# EAGLE design MicroChu-328-V2-Final (EAGLE 6.2)
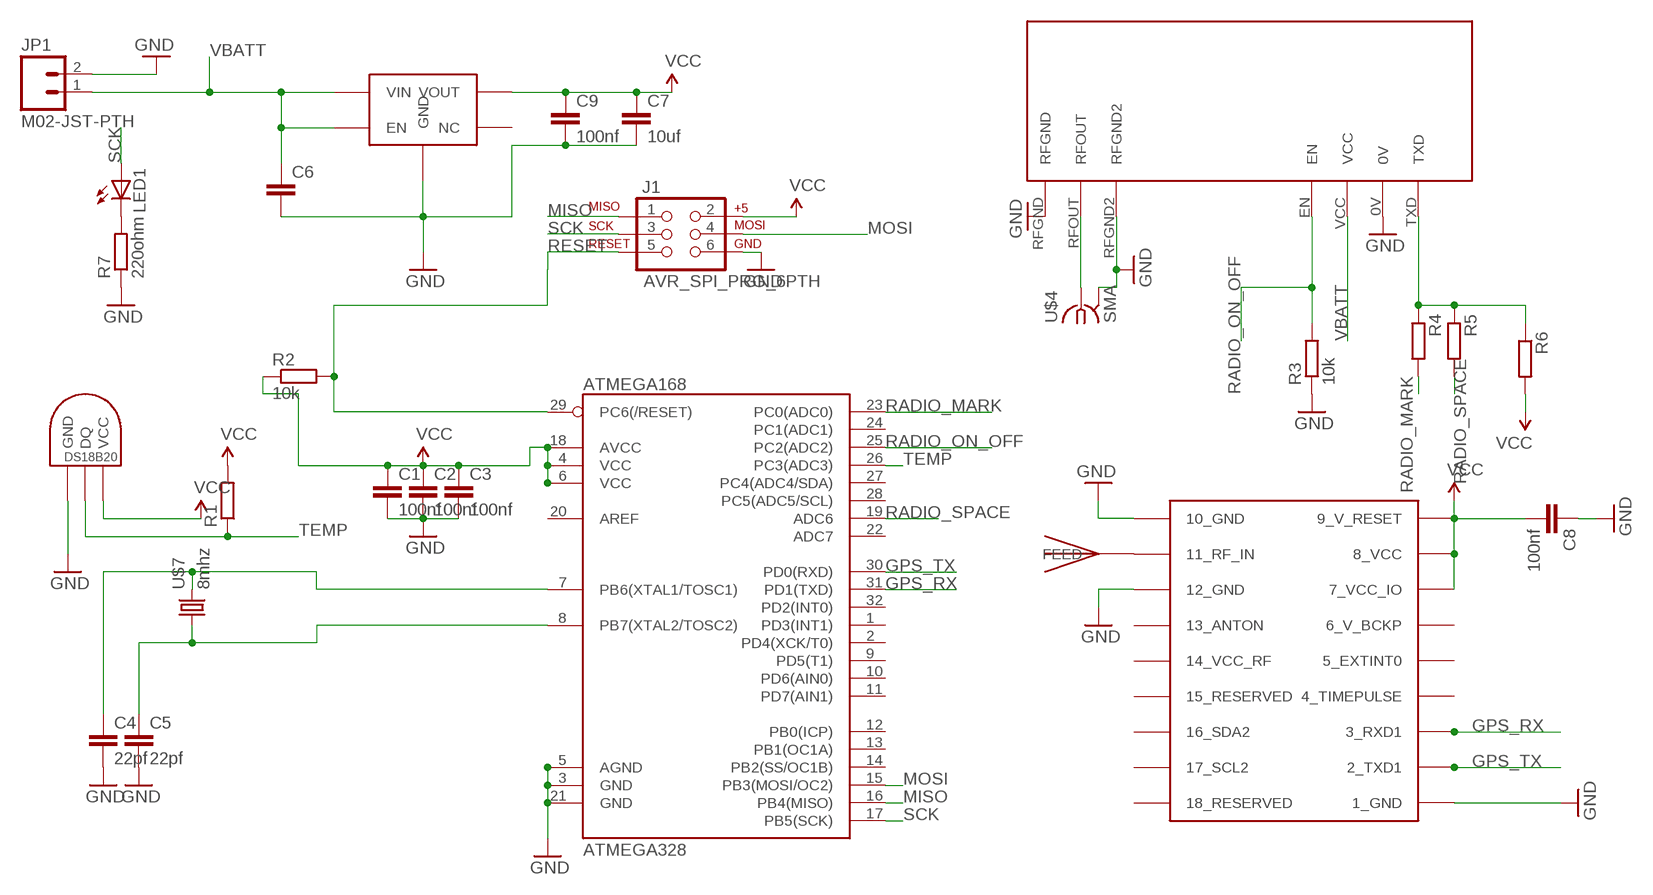
[diagram p0: schematic, sheet 1]

## Parts
3V3  ADP122AUJZ-3V3REG-5TSOT  [SOT23-5L]
ATMEGA328  ATMEGA168  [TQFP32-08]
C1  100nf  C-EUC0805  [C0805]
C2  100nf  C-EUC0805  [C0805]
C3  100nf  C-EUC0805  [C0805]
C4  22pf  C-EUC0805  [C0805]
C5  22pf  C-EUC0805  [C0805]
C6  C-EUC0805  [C0805]
C7  10uf  C-EUC0805  [C0805]
C8  100nf  C-EUC0805  [C0805]
C9  100nf  C-EUC0805  [C0805]
J1  AVR_SPI_PRG_6PTH  [2X3]
JP1  M02-JST-PTH  [M02-JST-PTH]
LED1  LED1206  [LED-1206]
R1  R-EU_R0805  [R0805]
R2  10k  R-EU_R0805  [R0805]
R3  10k  R-EU_R0805  [R0805]
R4  R-EU_R0805  [R0805]
R5  R-EU_R0805  [R0805]
R6  R-EU_R0805  [R0805]
R7  220ohm  R-EU_R0805  [R0805]
U$1  JTI_ANTENNA-1575AT43A40  [JTI_ANTENNA-1575AT43A40]
U$2  NTX2  [NTX2]
U$3  UBLOX_MAX-6  [UBLOX_MAX-6]
U$4  SMA  BU-SMA-H  [BU-SMA-H]
U$6  DS1820TO92  [DS1820]
U$7  8mhz  ABRACON_ABM3_CRYSTAL  [ABRACON_ABM3_CRYSTAL]

## Nets
GND: 3V3.2(GND) ATMEGA328.3(GND) ATMEGA328.5(AGND) ATMEGA328.21(GND) C1.2 C2.2 C3.2 C4.2 C5.2 C6.2 C7.2 C8.1 C9.2 J1.6 JP1.2 R3.1 R7.1 U$2.0V U$2.RFGND U$2.RFGND2 U$3.1_GND U$3.10_GND U$3.12_GND U$4.2(GND) U$6.GND
GPS_RX: ATMEGA328.31(PD1(TXD)) U$3.3_RXD1
GPS_TX: ATMEGA328.30(PD0(RXD)) U$3.2_TXD1
MISO: ATMEGA328.16(PB4(MISO)) J1.1
MOSI: ATMEGA328.15(PB3(MOSI/OC2)) J1.4
N$1: ATMEGA328.7(PB6(XTAL1/TOSC1)) C4.1 U$7.P$2
N$2: LED1.C R7.2
N$3: ATMEGA328.8(PB7(XTAL2/TOSC2)) C5.1 U$7.P$1
N$4: U$1.FEED U$3.11_RF_IN
N$5: R4.1 R5.1 R6.1 U$2.TXD
N$10: U$2.RFOUT U$4.1
RADIO_MARK: ATMEGA328.23(PC0(ADC0)) R4.2
RADIO_ON_OFF: ATMEGA328.25(PC2(ADC2)) R3.2 U$2.EN
RADIO_SPACE: ATMEGA328.19(ADC6) R5.2
RESET: ATMEGA328.29(PC6(/RESET)) J1.5 R2.2
SCK: ATMEGA328.17(PB5(SCK)) J1.3 LED1.A
TEMP: ATMEGA328.26(PC3(ADC3)) R1.1 U$6.DQ
VBATT: 3V3.1(VIN) 3V3.3(EN) C6.1 JP1.1 U$2.VCC
VCC: 3V3.5(VOUT) ATMEGA328.4(VCC) ATMEGA328.6(VCC) ATMEGA328.18(AVCC) C1.1 C2.1 C3.1 C7.1 C8.2 C9.1 J1.2 R1.2 R2.1 R6.2 U$3.7_VCC_IO U$3.8_VCC U$3.9_V_RESET U$6.VDD(VCC)
Unconnected: 3V3.4(NC) ATMEGA328.1(PD3(INT1)) ATMEGA328.2(PD4(XCK/T0)) ATMEGA328.9(PD5(T1)) ATMEGA328.10(PD6(AIN0)) ATMEGA328.11(PD7(AIN1)) ATMEGA328.12(PB0(ICP)) ATMEGA328.13(PB1(OC1A)) ATMEGA328.14(PB2(SS/OC1B)) ATMEGA328.20(AREF) ATMEGA328.22(ADC7) ATMEGA328.24(PC1(ADC1)) ATMEGA328.27(PC4(ADC4/SDA)) ATMEGA328.28(PC5(ADC5/SCL)) ATMEGA328.32(PD2(INT0)) U$3.4_TIMEPULSE U$3.5_EXTINT0 U$3.6_V_BCKP U$3.13_ANTON U$3.14_VCC_RF U$3.15_RESERVED U$3.16_SDA2 U$3.17_SCL2 U$3.18_RESERVED

## Power pins joined to a net without a drawn wire
GND: U$4.3(GND) U$4.4(GND) U$4.5(GND)

## Library data of the parts
3V3 = jonsowman:ADP122AUJZ-3V3REG-5TSOT
ATMEGA328 = SparkFun:ATMEGA168
C1-C9 = rcl:C-EU: CAPACITOR, European symbol
J1 = SparkFun:AVR_SPI_PRG_6: AVR ISP 6 Pin This is the reduced ISP connector for AVR programming. Common on Arduino. This footprint will take up less PCB space and can be used with a 10-pin to 6-pin adapter such as SKU: BOB-08508
JP1 = ava:M02-JST-PTH
LED1 = SparkFun:LED: LEDs Standard schematic elements and footprints for 5mm, 3mm, 1206, and 0603 sized LEDs. 5mm - Spark Fun Electronics SKU : COM-00529 (and others)
R1-R7 = resistor:R-EU_: RESISTOR, European symbol
U$1 = ava:JTI_ANTENNA-1575AT43A40
U$2 = ava:NTX2: Radiometrix NTX2 Transmitter Module Author Anthony Stirk / http://ava.upuaut.net
U$3 = ava:UBLOX_MAX-6: UBLOX MAX-6
U$4 = con-coax:BU-SMA-H: FEMALE SMA CONNECTOR Radiall; OC_FARNELL: unknown; OC_NEWARK: unknown
U$6 = ava:DS1820: DS18B20 Programmable Resolution 1-Wire Digital Thermometer Description The DS18B20 digital thermometer provides 9-bit to 12-bit Celsius temperature measurements and has an alarm function with nonvolatile user-programmable upper and lower trigger points. The DS18B20 communicates over a 1-Wire® bus that by definition requires only one data line (and ground) for communication with a central microprocessor. It has an operating temperature range of -55°C to +125°C and is accurate to ±0.5°C over the range of -10°C to +85°C. In addition, the DS18B20 can derive power directly from the data line ("parasite power"), eliminating the need for an external power supply. Each DS18B20 has a unique 64-bit serial code, which allows multiple DS18B20s to function on the same 1-Wire bus. Thus, it is simple to use one microprocessor to control many DS18B20s distributed over a large area. Applications that can benefit from this feature include HVAC environmental controls, temperature monitoring systems inside buildings, equipment, or machinery, and process monitoring and control systems.
U$7 = ava:ABRACON_ABM3_CRYSTAL

## Board
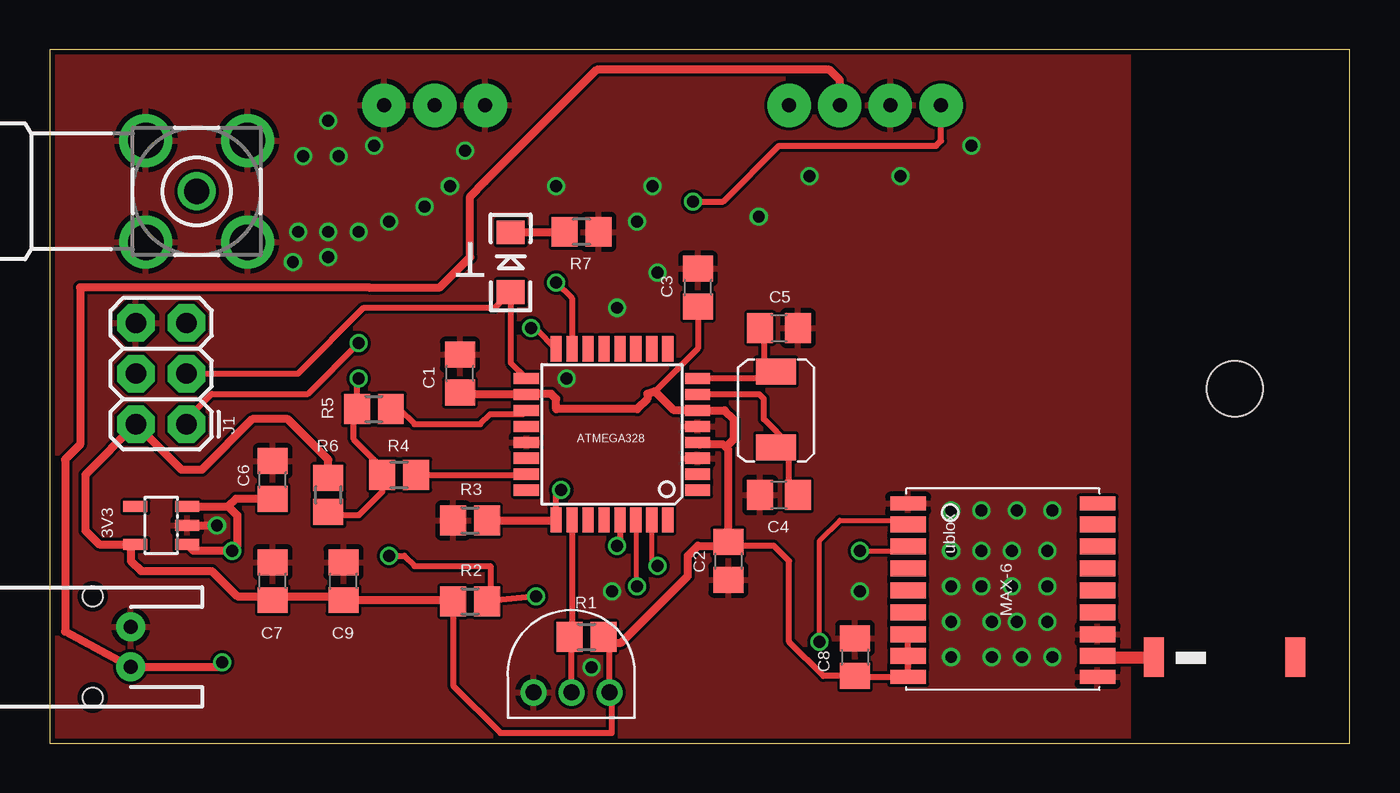
[diagram p1: board, top side]
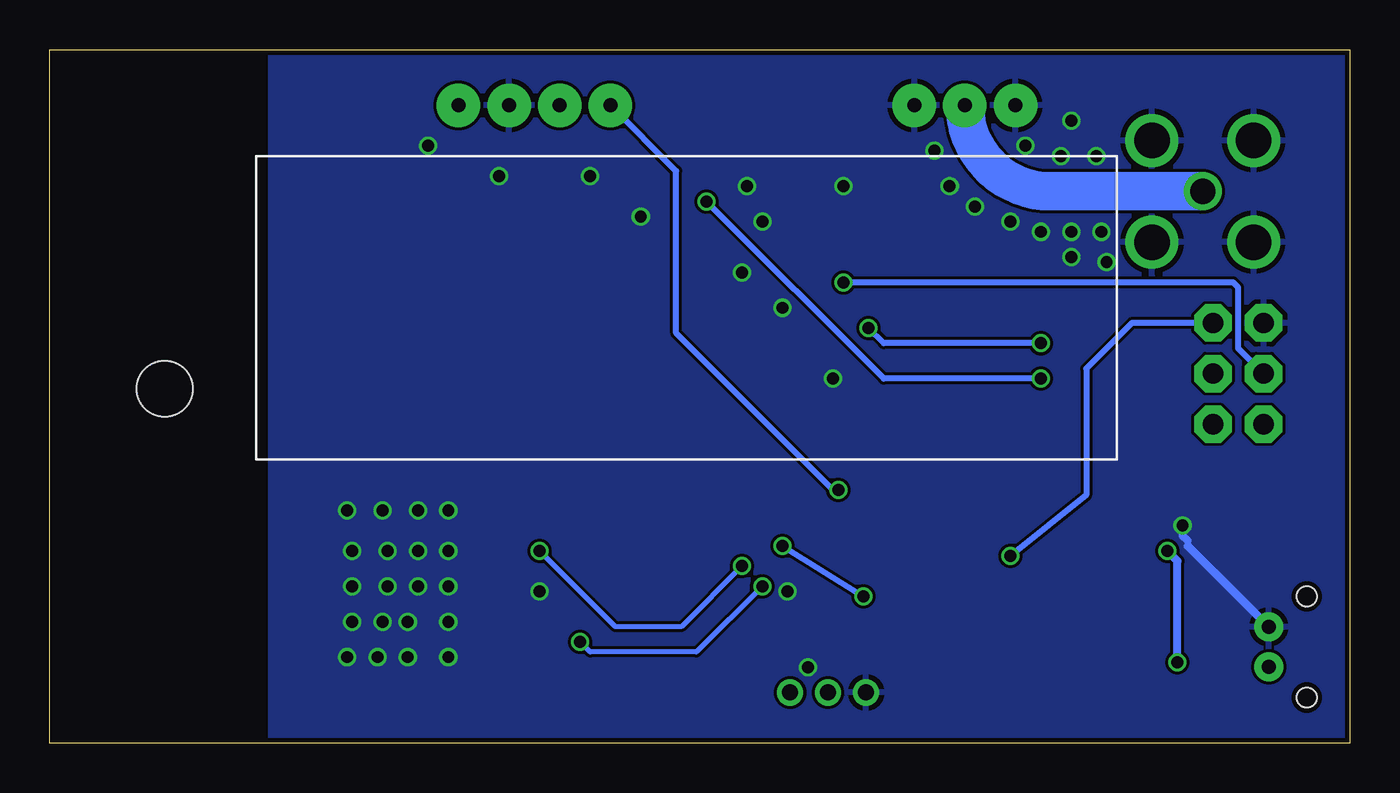
[diagram p2: board, bottom side, seen from below]

Size 65.2 x 34.79 mm. Coordinates in mm from the lower left corner, seen from the top.
Outline: 0,0 65.2,0 65.2,34.79 0,34.79 0,0
Copper layers (1*16): Top 0.035mm / dielectric 1.5mm / Bottom 0.035mm
Design rules: minimum track width 6mil, minimum drill 12mil, track to track 6mil, track to pad 6mil, pad to pad 6mil, via to via 6mil, smd to smd 0mil, copper to edge 10mil, drill to drill 10mil, minimum pad ring 10mil, minimum via ring 6mil, stop-mask expansion 2mil, vias tented up to drill 100mil, thermal gap 10mil
Holes 2.8 mm at 59.44,17.78

### Footprints (pad centres in the part's own frame; a part is rotated, then mirrored left to right if it is on the bottom)
SOT23-5L = smd 0.55 x 1.2: 1 -0.95,-1.3; 2 0,-1.3; 3 0.95,-1.3; 4 0.95,1.3; 5 -0.95,1.3
TQFP32-08 = smd 1.27 x 0.559: 1 -4.293,2.8; 2 -4.293,2; 3 -4.293,1.2; 4 -4.293,0.4; 5 -4.293,-0.4; 6 -4.293,-1.2; 7 -4.293,-2; 8 -4.293,-2.8; 17 4.293,-2.8; 18 4.293,-2; 19 4.293,-1.2; 20 4.293,-0.4; 21 4.293,0.4; 22 4.293,1.2; 23 4.293,2; 24 4.293,2.8 | smd 0.559 x 1.27: 9 -2.8,-4.293; 10 -2,-4.293; 11 -1.2,-4.293; 12 -0.4,-4.293; 13 0.4,-4.293; 14 1.2,-4.293; 15 2,-4.293; 16 2.8,-4.293; 25 2.8,4.293; 26 2,4.293; 27 1.2,4.293; 28 0.4,4.293; 29 -0.4,4.293; 30 -1.2,4.293; 31 -2,4.293; 32 -2.8,4.293
C0805 = smd 1.3 x 1.5: 1 -0.95,0; 2 0.95,0
2X3 = drill 1.016 pad 1.88 octagon: 1 0,0; 2 0,2.54; 3 2.54,0; 4 2.54,2.54; 5 5.08,0; 6 5.08,2.54
M02-JST-PTH = drill 0.7 pad 1.448: 1 -1,0; 2 1,0 | hole 1: -2.54,1.905; 2.54,1.905
LED-1206 = smd 1.2 x 1.4: A -1.5,0; C 1.5,0
R0805 = smd 1.3 x 1.5: 1 -0.85,0; 2 0.85,0
JTI_ANTENNA-1575AT43A40 = smd 1 x 2: FEED -3.81,-1.27; NC 3.29,-1.27
NTX2 = drill 0.7 pad 2.184: 0V -2.54,-10.16; EN -7.62,-10.16; RFGND -22.86,-10.16; RFGND2 -27.94,-10.16; RFOUT -25.4,-10.16; TXD 0,-10.16; VCC -5.08,-10.16
UBLOX_MAX-6 = smd 1.8 x 0.7: 1_GND 4.95,-4.4; 9_V_RESET 4.95,4.3; 10_GND -4.55,4.3; 18_RESERVED -4.55,-4.4 | smd 1.8 x 0.8: 2_TXD1 4.95,-3.35; 3_RXD1 4.95,-2.25; 4_TIMEPULSE 4.95,-1.15; 5_EXTINT0 4.95,-0.05; 6_V_BCKP 4.95,1.05; 7_VCC_IO 4.95,2.15; 8_VCC 4.95,3.25; 11_RF_IN -4.55,3.25; 12_GND -4.55,2.15; 13_ANTON -4.55,1.05; 14_VCC_RF -4.55,-0.05; 15_RESERVED -4.55,-1.15; 16_SDA2 -4.55,-2.25; 17_SCL2 -4.55,-3.35
BU-SMA-H = drill 1.27: 1 0,0 | drill 1.778: 2 -2.55,2.55; 3 2.55,2.55; 4 2.55,-2.55; 5 -2.55,-2.55
DS1820 = drill 0.8: DQ 2.54,-1.27; GND 0.635,-1.27; VDD 4.445,-1.27
ABRACON_ABM3_CRYSTAL = smd 1.3 x 2: P$1 -3.4,0.1; P$2 0.4,0.1

### Placement (x,y rotation side)
3V3  5.59,10.92 90 top
ATMEGA328  28.19,15.49 180 top
C1  20.57,18.54 90 top
C2  34.04,9.14 270 top
C3  32.51,22.86 90 top
C4  36.58,12.45 180 top
C5  36.58,20.83 0 top
C6  11.18,13.21 90 top
C7  11.18,8.13 90 top
C8  40.39,4.32 270 top
C9  14.73,8.13 90 top
J1  6.86,16 90 top
JP1  4.06,4.83 90 top
LED1  23.11,24.13 90 top
R1  26.92,5.33 0 top
R2  21.08,7.11 0 top
R3  21.08,11.18 0 top
R4  17.53,13.46 0 top
R5  16.26,16.76 0 top
R6  13.97,12.45 90 top
R7  26.67,25.65 180 top
U$1  59.18,5.59 0 top
U$2  44.7,21.84 180 bottom
U$3  48.01,7.62 180 top
U$4  7.37,27.69 180 top
U$6  23.62,3.81 0 top
U$7  36.32,15.24 270 top

### Tracks (layer width: path | path; a pad name or v marks a point on that pad's centre or on a via)
GND  (via drill 0.6)
  Top 0.406: 3V3.2 v8.38,10.92
  Bottom 0.305: 8.13,10.16 8.13,9.89
  Bottom 0.406: v8.38,10.92 8.38,10.41 8.13,10.16 | 8.13,9.89 JP1.2
  other vias: 28.19,7.62 40.64,7.62 45.21,11.68 46.74,11.68 50.29,11.68 48.51,11.68 45.21,9.65 46.74,9.65 48.26,9.65 50.04,9.65 45.21,7.87 46.74,7.87 48.26,7.87 50.04,7.87 45.21,6.1 47.24,6.1 50.04,6.1 48.51,6.1 45.21,4.32 47.24,4.32 48.77,4.32 50.29,4.32 12.45,25.65 20.83,29.72 16.26,29.97 14.48,29.46 12.7,29.46 46.23,29.97 42.67,28.45 38.1,28.45 35.56,26.42 30.23,27.94 29.46,26.16 25.4,27.94 15.49,25.65 13.97,24.38 17.02,26.16 13.97,25.65 12.19,24.13 13.97,31.24 18.8,26.92 20.07,27.94 25.91,18.29 27.18,3.81 30.48,23.62 28.45,21.84
  pour Top: 0,34.8 0,0 54.1,0 54.1,34.8
  pour Bottom: 0,34.8 0,0 54.1,0 54.1,34.8
GPS_RX  (via drill 0.6)
  Top 0.254: ATMEGA328.31 30.19,9.18 v30.48,8.89 | v40.64,9.65 42.84,9.65 U$3.3_RXD1
  Bottom 0.254: v30.48,8.89 33.53,5.84 36.32,5.84 36.83,5.84 v40.64,9.65
GPS_TX  (via drill 0.6)
  Top 0.254: ATMEGA328.30 29.39,7.94 v29.46,7.87 | v38.61,5.08 38.61,10.16 39.62,11.18 42.85,11.18 U$3.2_TXD1
  Bottom 0.254: v29.46,7.87 32.77,4.57 38.1,4.57 v38.61,5.08
MISO  (via drill 0.6)
  Top 0.305: J1.1 6.86,16.26 8.13,17.53 12.95,17.53 v15.49,20.07 | v24.13,20.83 24.35,20.83 ATMEGA328.16
  Bottom 0.305: v15.49,20.07 23.37,20.07 v24.13,20.83
MOSI  (via drill 0.6)
  Top 0.305: v25.4,23.11 26.19,22.32 ATMEGA328.15
  Bottom 0.305: J1.4 5.59,19.81 5.59,22.86 5.84,23.11 v25.4,23.11
N$1
  Top 0.305: C4.1 37.08,12.89 37.08,14.99 | 37.08,14.99 35.81,16.26 35.81,17.27 35.59,17.49 ATMEGA328.7 | 37.08,14.99 36.94,14.84 U$7.P$2
N$2
  Top 0.406: LED1.C 25.8,25.63 R7.2
N$3
  Top 0.305: C5.1 35.81,20.64 35.81,18.54 | 35.81,18.54 35.57,18.29 ATMEGA328.8 | 35.81,18.54 35.91,18.64 U$7.P$1
N$4
  Top 0.61: U$3.11_RF_IN 52.61,4.32 U$1.FEED
N$5  (via drill 0.6)
  Top 0.305: 14.14,11.43 15.49,11.43 16.68,12.61 R4.1 16.68,13.8 15.24,15.24 15.24,16.6 R5.1 15.41,18.2 v15.49,18.29 | v32.26,27.18 33.78,27.18 36.58,29.97 44.45,29.97 44.7,30.23 U$2.TXD
  Top 0.406: 14.14,11.43 R6.1
  Bottom 0.305: v15.49,18.29 23.37,18.29 v32.26,27.18
N$10
  Bottom 1.93: U$4.1 14.99,27.69 arc90 U$2.RFOUT
RADIO_MARK
  Top 0.305: R4.2 23.87,13.46 ATMEGA328.23
RADIO_ON_OFF  (via drill 0.6)
  Top 0.305: ATMEGA328.25 25.39,12.44 v25.65,12.7
  Top 0.406: R3.2 25.37,11.18 ATMEGA328.25
  Bottom 0.305: v25.65,12.7 25.91,12.7 33.78,20.57 33.78,28.7 U$2.EN
RADIO_SPACE
  Top 0.305: R5.2 17.53,16.76 18.29,16 21.59,16 22.1,16.51 23.72,16.51 ATMEGA328.19
RESET  (via drill 0.6)
  Top 0.305: v17.02,9.4 17.78,9.4 18.29,8.89 22.1,8.89 22.1,7.28 R2.2 | 22.1,7.79 R2.2 | ATMEGA328.29 28.59,10.05 v28.45,9.91 | v24.38,7.37 R2.2
  Bottom 0.305: J1.5 10.92,21.08 13.21,18.8 13.21,12.45 v17.02,9.4 | v28.45,9.91 v24.38,7.37
SCK
  Top 0.305: J1.3 12.45,18.54 15.75,21.84 22.33,21.84 LED1.A 23.11,19.08 ATMEGA328.17
TEMP
  Top 0.305: U$6.DQ 26.16,5.25 R1.1 26.19,5.45 ATMEGA328.26
VBATT  (via drill 0.6)
  Top 0.406: v8.64,4.06 8.4,3.83 JP1.1 0.76,5.6 0.76,14.22 1.52,14.99 1.52,22.86 16,22.86 19.56,22.86 21.08,24.38 21.08,27.43 21.84,28.19 27.43,33.78 39.12,33.78 39.62,33.27 U$2.VCC | 3V3.1 7.21,9.65 v9.14,9.65 9.4,9.91 9.4,11.43 8.96,11.87 | 3V3.3 8.96,11.87 | C6.1 9.34,12.26 8.96,11.87
  Bottom 0.406: v8.64,4.06 8.64,9.14 v9.14,9.65 | 3.83,4.06 JP1.1
VCC
  Top 0.305: 43.06,3.81 U$3.9_V_RESET 40.43,3.32 C8.2 38.8,3.37 37.08,5.08 37.08,9.14 36.32,9.91 34.22,9.91 C2.1 | 43.06,3.81 U$3.8_VCC | U$3.8_VCC U$3.7_VCC_IO | U$3.8_VCC 43.06,3.81 | C3.1 32.51,19.81 30.35,17.65 | R2.1 20.23,2.88 22.61,0.51 28.19,0.51 28.19,2.41 U$6.VDD 28.07,5.04 R1.2
  Top 0.406: R1.2 28.07,5.04 28.66,5.04 28.96,5.33 32,8.38 32,9.4 32.51,9.91 33.85,9.91 C2.1 34.04,14.73 33.91,14.86 | 33.91,14.86 33.78,14.99 32.6,14.99 ATMEGA328.4 | 33.91,14.86 34.29,15.24 34.29,16.26 33.85,16.69 ATMEGA328.6 31.31,16.69 30.35,17.65 29.97,17.53 29.97,17.27 29.46,16.76 25.4,16.76 25.4,17.27 25.15,17.53 23.93,17.53 | 23.93,17.53 ATMEGA328.18 | ATMEGA328.18 20.67,17.49 C1.1 | R2.1 20.17,7.18 C9.1 14.54,7.37 11.18,7.37 C7.1 10.99,7.37 9.4,7.37 8.13,8.64 4.57,8.64 4.06,9.14 4.06,9.91 4.13,9.97 3V3.5 2.47,9.97 1.78,10.67 1.78,13.46 J1.2 6.6,13.72 7.62,13.72 10.16,16.26 11.94,16.26 13.97,14.22 R6.2 | 23.93,17.53 ATMEGA328.18

### Text on the board
tPlace: T
tStop: µChu V1.0 By Nigel Smart